# EAGLE design CellAlarm (EAGLE 6.5.0)
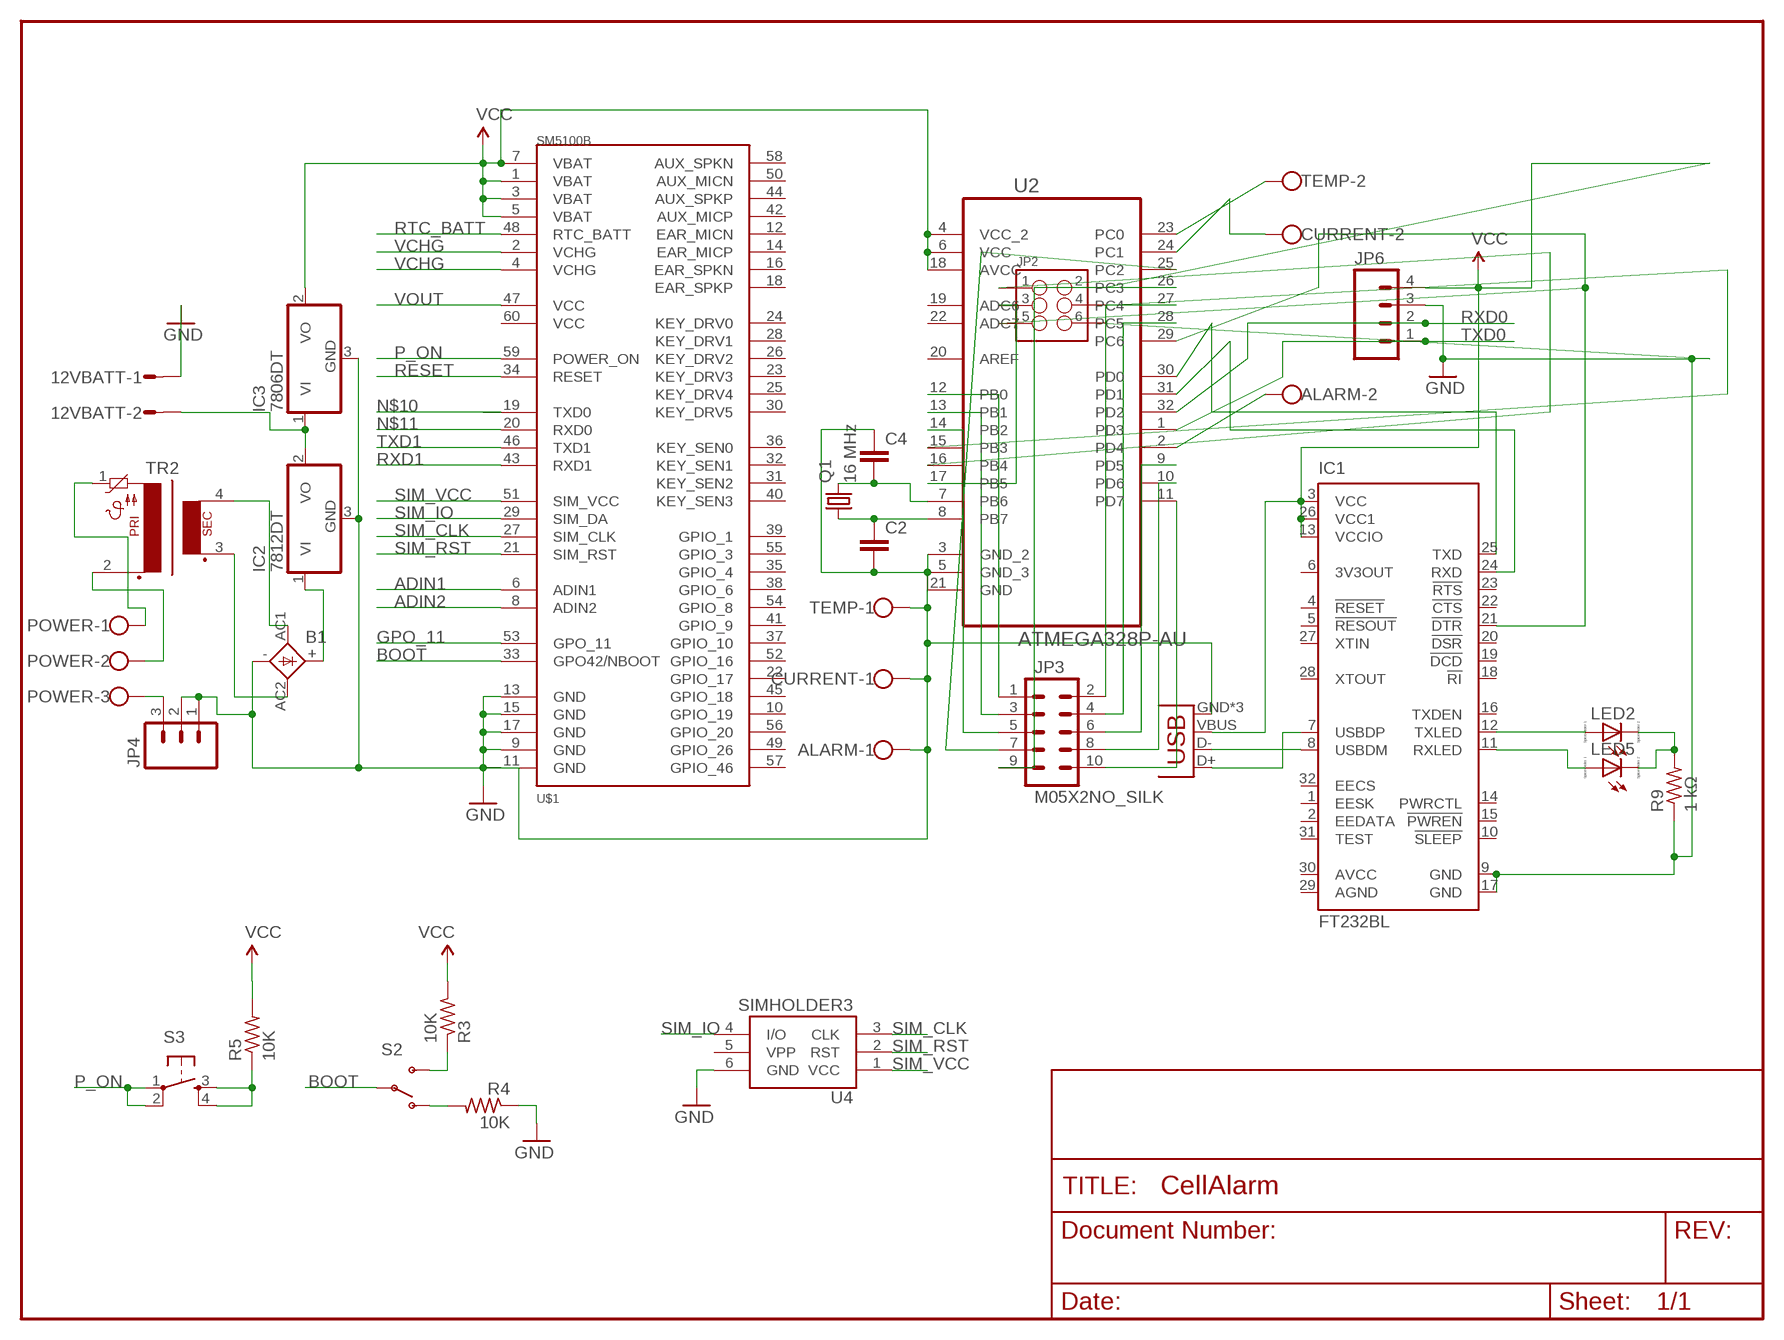
[diagram p0: schematic, sheet 1]

## Parts
12VBATT  M02S  [02P]
ALARM  W239-302  [W239-302]
B1  2KBB-R  [2KBB-R]
C2  C2.5/2  [C2.5-2]
C4  C2.5/2  [C2.5-2]
CURRENT  W239-302  [W239-302]
IC1  FT232BL  [LQFP32-7X7]
IC2  7812DT  [TO252]
IC3  7806DT  [TO252]
JP1  USB-MICROB  [USB-MICROB]
JP2  M03X2NO_SILK  [2X3-NS]
JP3  M05X2NO_SILK  [2X5_NOSILK]
JP4  M03LONGPADS  [1X03_LONGPADS]
JP6  M04PTH  [1X04]
LED2  LED_E  [LED_1206]
LED5  LED_E  [LED_1206]
POWER  W239-103  [W239-103]
Q1  16 MHz  CRYSTALHC33U-V  [HC33U-V]
R3  10K  R-US_R0603  [R0603]
R4  10K  R-US_R0603  [R0603]
R5  10K  R-US_R0603  [R0603]
R9  1 kΩ  R-US_M0805  [M0805]
S2  SWITCH-SPSTSMD  [AYZ0202]
S3  TAC_SWITCHSMD  [TACTILE_SWITCH_SMD]
TEMP  W239-302  [W239-302]
TR2  PT04,5-1  [PT04,5-1]
U2  ATMEGA328P-AU  [QFP80P900X900X120-32N]
U4  SIMHOLDER3  [SIMHOLDER3]
U$1  SM5100B  [SM5100B]

## Nets
ADIN1: U$1.6(ADIN1)
ADIN2: U$1.8(ADIN2)
BOOT: S2.2(P) U$1.33(GPO42/NBOOT)
GND: 12VBATT.1 ALARM.1 B1.- C2.2 C4.1 CURRENT.1 IC1.9(GND) IC1.17(GND) IC2.3(GND) IC3.3(GND) JP1.GND JP1.MT1(GND) JP1.MT2(GND) JP2.6 JP4.1 JP4.2 JP6.3 R4.1 R9.1 TEMP.1 U2.3(GND_2) U2.5(GND_3) U2.21(GND) U4.6(GND) U$1.9(GND) U$1.11(GND) U$1.13(GND) U$1.15(GND) U$1.17(GND)
GPO_11: U$1.53(GPO_11)
N$1: POWER.1 TR2.1
N$2: POWER.2 TR2.2
N$3: B1.AC2 TR2.3
N$4: B1.AC1 TR2.4
N$5: IC1.12(TXLED) LED2.A
N$6: B1.+ IC2.1(VI)
N$7: 12VBATT.2 IC2.2(VO) IC3.1(VI)
N$8: TEMP.2 U2.23(PC0)
N$9: CURRENT.2 U2.24(PC1)
N$10: U$1.19(TXD0)
N$11: U$1.20(RXD0)
N$12: JP4.3 POWER.3
N$15: R3.1 S2.3(S)
N$16: R4.2 S2.1(O)
N$19: ALARM.2 U2.2(PD4)
N$20: R5.1 S3.3 S3.4
N$21: IC1.11(RXLED) LED5.A
N$22: LED2.C LED5.C R9.2
N$25: IC1.7(USBDP) JP1.D+
N$26: IC1.8(USBDM) JP1.D-
N$27: IC1.25(TXD) U2.30(PD0)
N$28: IC1.24(RXD) U2.31(PD1)
N$29: IC1.21(!DTR) JP2.5 U2.29(PC6)
N$31: JP2.4 U2.15(PB3)
N$32: JP2.1 U2.16(PB4)
N$33: JP2.3 U2.17(PB5)
N$34: C4.2 Q1.2 U2.7(PB6)
N$35: C2.1 Q1.1 U2.8(PB7)
N$37: JP3.1 U2.12(PB0)
N$38: JP3.3 U2.13(PB1)
N$39: JP3.5 U2.14(PB2)
N$40: JP3.7 U2.25(PC2)
N$41: JP3.9 U2.26(PC3)
N$42: JP3.2 U2.27(PC4)
N$43: JP3.4 U2.28(PC5)
N$44: JP3.6 U2.9(PD5)
N$45: JP3.8 U2.10(PD6)
N$46: JP3.10 U2.11(PD7)
P_ON: S3.1 S3.2 U$1.59(POWER_ON)
RESET: U$1.34(RESET)
RTC_BATT: U$1.48(RTC_BATT)
RXD0: JP6.2 U2.32(PD2)
RXD1: U$1.43(RXD1)
SIM_CLK: U4.3(CLK) U$1.27(SIM_CLK)
SIM_IO: U4.4(I/O) U$1.29(SIM_DA)
SIM_RST: U4.2(RST) U$1.21(SIM_RST)
SIM_VCC: U4.1(VCC) U$1.51(SIM_VCC)
TXD0: JP6.1 U2.1(PD3)
TXD1: U$1.46(TXD1)
VCC: IC1.3(VCC) IC1.13(VCCIO) IC1.26(VCC1) IC3.2(VO) JP1.VBUS JP2.2 JP6.4 R3.2 R5.2 U2.4(VCC_2) U2.6(VCC) U2.18(AVCC) U$1.1(VBAT) U$1.3(VBAT) U$1.5(VBAT) U$1.7(VBAT)
VCHG: U$1.2(VCHG) U$1.4(VCHG)
VOUT: U$1.47(VCC)
Unconnected: IC1.1(EESK) IC1.2(EEDATA) IC1.4(!RESET) IC1.5(!RESOUT) IC1.6(3V3OUT) IC1.10(!SLEEP) IC1.14(PWRCTL) IC1.15(!PWREN) IC1.16(TXDEN) IC1.18(!RI) IC1.19(!DCD) IC1.20(!DSR) IC1.22(!CTS) IC1.23(!RTS) IC1.27(XTIN) IC1.28(XTOUT) IC1.31(TEST) IC1.32(EECS) U2.19(ADC6) U2.20(AREF) U2.22(ADC7) U4.5(VPP) U$1.10(GPIO_19) U$1.12(EAR_MICN) U$1.14(EAR_MICP) U$1.16(EAR_SPKN) U$1.18(EAR_SPKP) U$1.22(GPIO_17) U$1.23(KEY_DRV3) U$1.24(KEY_DRV0) U$1.25(KEY_DRV4) U$1.26(KEY_DRV2) U$1.28(KEY_DRV1) U$1.30(KEY_DRV5) U$1.31(KEY_SEN2) U$1.32(KEY_SEN1) U$1.35(GPIO_4) U$1.36(KEY_SEN0) U$1.37(GPIO_10) U$1.38(GPIO_6) U$1.39(GPIO_1) U$1.40(KEY_SEN3) U$1.41(GPIO_9) U$1.42(AUX_MICP) U$1.44(AUX_SPKP) U$1.45(GPIO_18) U$1.49(GPIO_26) U$1.50(AUX_MICN) U$1.52(GPIO_16) U$1.54(GPIO_8) U$1.55(GPIO_3) U$1.56(GPIO_20) U$1.57(GPIO_46) U$1.58(AUX_SPKN) U$1.60(VCC)

## Power pins joined to a net without a drawn wire
AGND: IC1.29(AGND)
AVCC: IC1.30(AVCC)

## Library data of the parts
12VBATT = con-amp-quick:M02S: AMP QUICK CONNECTOR; OC_FARNELL: unknown; OC_NEWARK: unknown
ALARM CURRENT TEMP = con-wago-500:W239-302: WAGO SCREW CLAMP; OC_FARNELL: unknown; OC_NEWARK: unknown
B1 = rectifier:2KBB-R: RECTIFIER grid 3 x 5 mm
C2 C4 = capacitor-wima:C: CAPACITOR naming: grid - package width
IC1 = ftdichip:FT232B: USB to serial UART interface Source: DS_FT232BL_BQ.pdf; MF: FARNELL; MPN: FT232BL/TR; OC_FARNELL: unknown; OC_NEWARK: 38K1551
IC2 IC3 = linear:78*: Positive VOLTAGE REGULATOR Source: http://cache.national.com/ds/LM/LM78L05.pdf http://www.fairchildsemi.com/ds/LM/LM7805.pdf
JP1 = SparkFun-Connectors:USB: USB Connectors USB-B-PTH is fully proven SKU : PRT-00139/CONN-08278 USB-miniB is fully proven SKU : PRT-00587 USB-A-PCB is untested. USB-A-H is throughly reviewed, but untested. Spark Fun Electronics SKU : PRT-00437 USB-B-SMT is throughly reviewed, but untested. Needs silkscreen touching up. USB-A-S has not been used/tested USB-MB-H has not been used/tested USB-MICROB has been used. CONN-09505; PROD_ID: CONN-09505
JP2 = SparkFun-Connectors:M03X2: 2x3 .1" header. Shrouded, with keying- CONN-10681 SMT- CONN-11415 Pogo pins- HW-11044
JP3 = SparkFun-Connectors:M05X2: Header 5x2 Standard 10-pin dual row 0.1" header. Commonly used with AVR-ISP. Use with Spark Fun Electronics SKU: PRT-00778
JP4 = SparkFun-Connectors:M03: Header 3 Standard 3-pin 0.1" header. Use with straight break away headers (SKU : PRT-00116), right angle break away headers (PRT-00553), swiss pins (PRT-00743), machine pins (PRT-00117), and female headers (PRT-00115). Molex polarized connector foot print use with SKU : PRT-08232 with associated crimp pins and housings.
JP6 = SparkFun:M04: Header 4 Standard 4-pin 0.1" header. Use with straight break away headers (SKU : PRT-00116), right angle break away headers (PRT-00553), swiss pins (PRT-00743), machine pins (PRT-00117), and female headers (PRT-00115). Molex polarized connector foot print use with SKU : PRT-08231 with associated crimp pins and housings.
LED2 LED5 = eagle-ltspice:LED_E: LED Source: http://www.osram.convergy.de Source: www.luxeon.com Source: www.kingbright.com; SPICEMODEL: NONE; SPICEPREFIX: D; SPICETYPE: diode
POWER = con-wago-500:W239-103: WAGO SCREW CLAMP; MPN: 239-103; OC_FARNELL: unknown; OC_NEWARK: 33M7170
Q1 = crystal:CRYSTAL: CRYSTAL; OC_FARNELL: unknown; OC_NEWARK: unknown
R3-R5 = rcl:R-US_: RESISTOR, American symbol
R9 = resistor:R-US_: RESISTOR, American symbol
S2 = SparkFun:SWITCH-SPST: SPST Switch Simple slide switch. Spark Fun Electronics SKU : COM-00102
S3 = SparkFun:TAC_SWITCH: Momentary Switch Button commonly used for reset or general input. Spark Fun Electronics SKU : COM-00097
TR2 = trafo:PT04,5-1: TRANSFORMER 1 primary winding, temp. protection fuse, 1 secondary winding/ mounting hole BLOCK
U2 = Atmel_By_element14_Batch_1-00:ATMEGA328P-AU: 8-bit Microcontroller with In-System Programmable Flash; MPN: ATMEGA328P-AU; OC_FARNELL: 1715486; OC_NEWARK: 14R4631; PACKAGE: TQFP-32; SUPPLIER: Atmel
U4 = SparkFun:SIMHOLDER3
U$1 = SparkFun:SM5100B

## Net classes
0 default: width 0.203 mm
1 vcc: width 0.254 mm

## Board
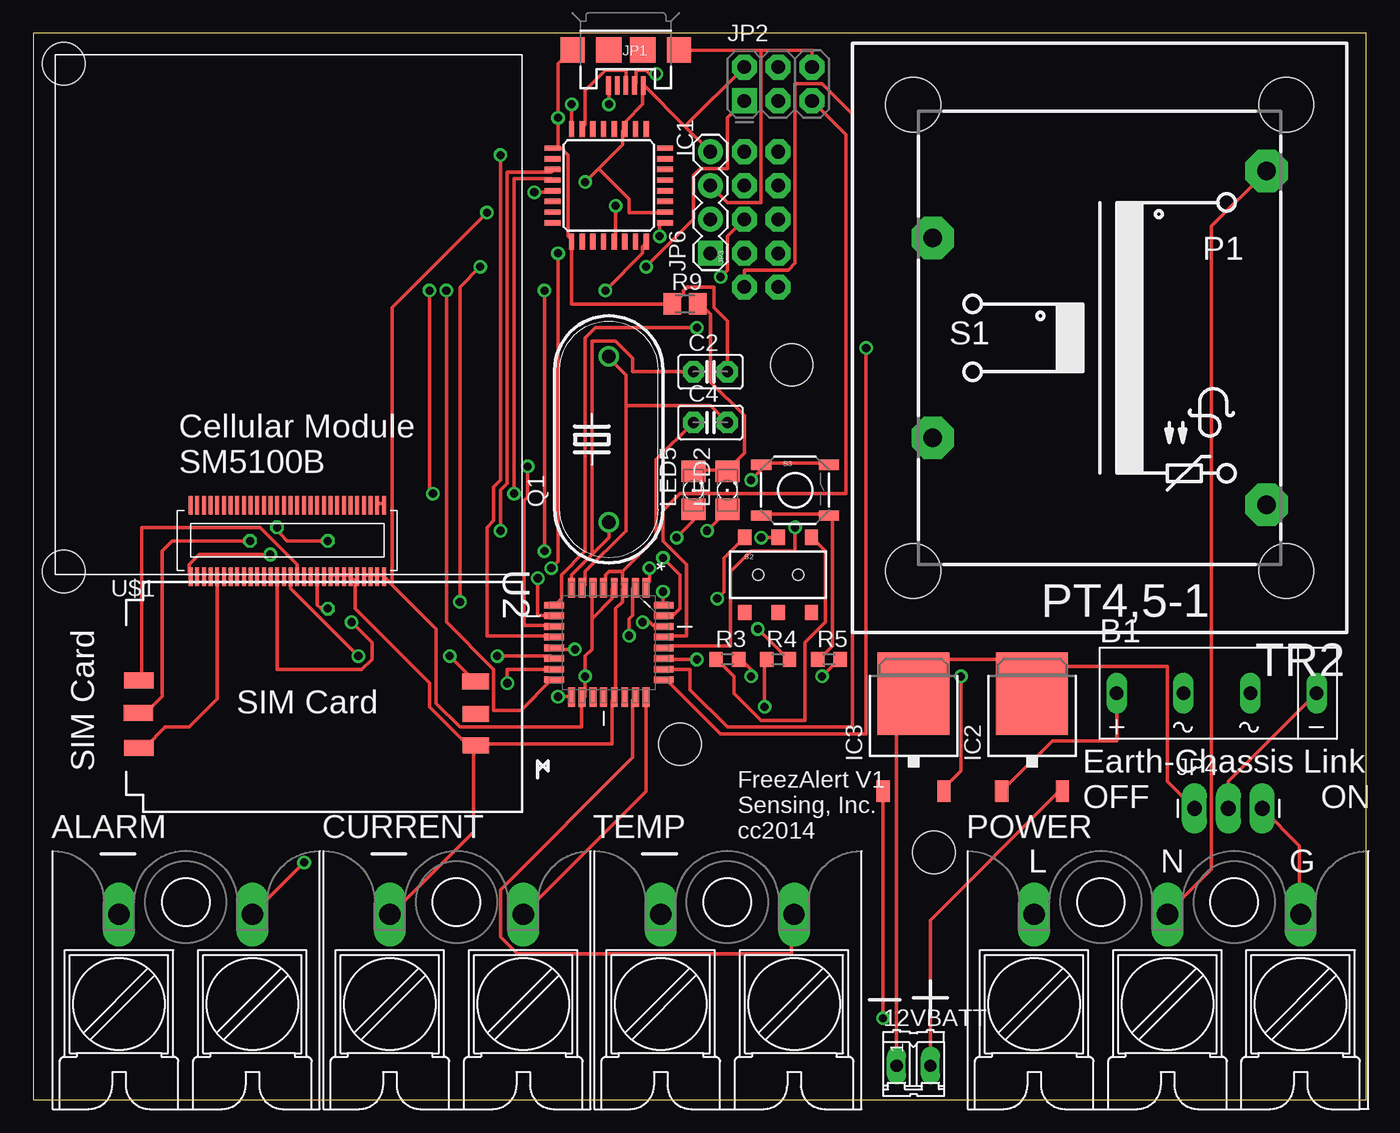
[diagram p1: board, top side]
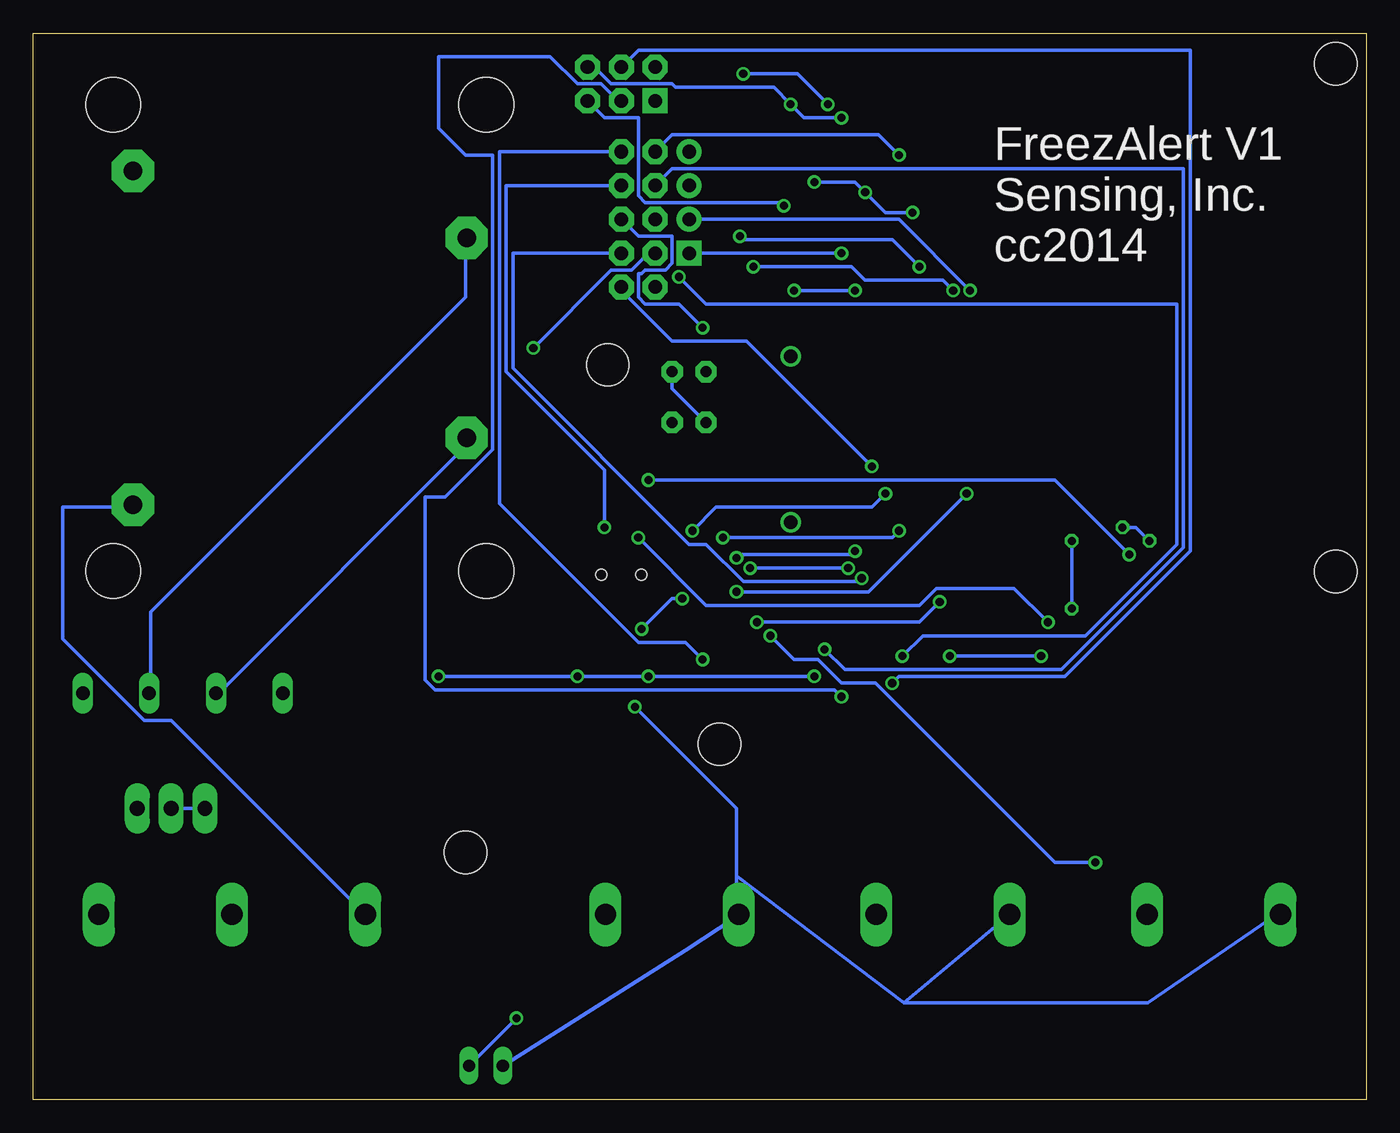
[diagram p2: board, bottom side, seen from below]

Size 100 x 80 mm. Coordinates in mm from the lower left corner, seen from the top.
Outline: 0,0 100,0 100,80 0,80 0,0
Copper layers (1*16): Top 0.035mm / dielectric 1.5mm / Bottom 0.035mm
Design rules "default": minimum track width 10mil, minimum drill 24mil, track to track 8mil, track to pad 8mil, pad to pad 8mil, via to via 8mil, smd to smd 8mil, copper to edge 40mil, drill to drill 8mil, minimum pad ring 10mil, minimum via ring 8mil, stop-mask expansion 4mil, vias tented up to drill 0mil, thermal gap 10mil
Holes 3.17 mm at 2.29,77.72 67.56,18.54 48.51,26.67 56.9,55.12 2.29,39.62

### Footprints (pad centres in the part's own frame; a part is rotated, then mirrored left to right if it is on the bottom)
02P = drill 0.914 long: 1 -1.27,0; 2 1.27,0
W239-302 = drill 1.6 long: 1 -5,5; 2 5,5
2KBB-R = drill 1.016 long: + -7.62,0; - 7.391,0; AC1 -2.616,0; AC2 2.413,0
C2.5-2 = drill 0.813 pad 1.6 octagon: 1 -1.27,0; 2 1.27,0
LQFP32-7X7 = smd 1.2 x 0.4: 1 -4.225,2.8; 2 -4.225,2; 3 -4.225,1.2; 4 -4.225,0.4; 5 -4.225,-0.4; 6 -4.225,-1.2; 7 -4.225,-2; 8 -4.225,-2.8; 17 4.225,-2.8; 18 4.225,-2; 19 4.225,-1.2; 20 4.225,-0.4; 21 4.225,0.4; 22 4.225,1.2; 23 4.225,2; 24 4.225,2.8 | smd 0.4 x 1.2: 9 -2.8,-4.225; 10 -2,-4.225; 11 -1.2,-4.225; 12 -0.4,-4.225; 13 0.4,-4.225; 14 1.2,-4.225; 15 2,-4.225; 16 2.8,-4.225; 25 2.8,4.225; 26 2,4.225; 27 1.2,4.225; 28 0.4,4.225; 29 -0.4,4.225; 30 -1.2,4.225; 31 -2,4.225; 32 -2.8,4.225
TO252 = smd 1 x 1.6: 1 -2.28,-4.8; 2 2.28,-4.8 | smd 5.4 x 6.2: 3 0,2.5
USB-MICROB = smd 0.35 x 1.4: D+ 0,2.65; D- -0.65,2.65; GND 1.3,2.65; ID 0.65,2.65; VBUS -1.3,2.65 | smd 1.8 x 1.9: MT1 -4,0; MT2 4,0 | smd 1.9 x 1.9: P$1 -1.27,0; P$2 1.27,0
2X3-NS = drill 1.016 pad 1.88 square: 1 -2.54,-1.27 | drill 1.016 pad 1.88 octagon: 2 -2.54,1.27; 3 0,-1.27; 4 0,1.27; 5 2.54,-1.27; 6 2.54,1.27
2X5_NOSILK = drill 1.016 pad 1.88 octagon: 1 -1.27,5.08; 2 1.27,5.08; 3 -1.27,2.54; 4 1.27,2.54; 5 -1.27,0; 6 1.27,0; 7 -1.27,-2.54; 8 1.27,-2.54; 9 -1.27,-5.08; 10 1.27,-5.08
1X03_LONGPADS = drill 1.118 pad 1.88 long: 1 0,0; 2 2.54,0; 3 5.08,0
1X04 = drill 1.016 pad 1.88 square: 1 0,0 | drill 1.016 pad 1.88: 2 2.54,0; 3 5.08,0; 4 7.62,0
LED_1206 = smd 1.6 x 1.803: A -1.422,0; C 1.422,0
W239-103 = drill 1.6 long: 1 -10,5; 2 0,5; 3 10,5
HC33U-V = drill 1.016: 1 -6.223,0; 2 6.223,0
R0603 = smd 1 x 1.1: 1 -0.85,0; 2 0.85,0
M0805 = smd 1.3 x 1.6: 1 -0.95,0; 2 0.95,0
AYZ0202 = smd 1 x 1.15: 1 -2.5,2.825; 2 0,2.825; 3 2.5,2.825; 4 -2.5,-2.825; 5 0,-2.825; 6 2.5,-2.825 | hole 0.85: 1.5,0; -1.5,0
TACTILE_SWITCH_SMD = smd 1.524 x 0.762: 1 -2.54,1.905; 2 2.54,1.905; 3 -2.54,-1.905; 4 2.54,-1.905
PT04,5-1 = drill 1.397 pad 3.175 octagon: 1 -12.522,12.522; 2 -12.522,-12.522; 3 12.522,-7.493; 4 12.522,7.493 | hole 4.115: -13.995,-17.501; -13.995,17.501; 13.995,17.501; 13.995,-17.501
QFP80P900X900X120-32N = smd 1.473 x 0.508: 1 -4.115,2.794; 2 -4.115,2.007; 3 -4.115,1.194; 4 -4.115,0.406; 5 -4.115,-0.406; 6 -4.115,-1.194; 7 -4.115,-2.007; 8 -4.115,-2.794; 17 4.115,-2.794; 18 4.115,-2.007; 19 4.115,-1.194; 20 4.115,-0.406; 21 4.115,0.406; 22 4.115,1.194; 23 4.115,2.007; 24 4.115,2.794 | smd 0.508 x 1.473: 9 -2.794,-4.115; 10 -2.007,-4.115; 11 -1.194,-4.115; 12 -0.406,-4.115; 13 0.406,-4.115; 14 1.194,-4.115; 15 2.007,-4.115; 16 2.794,-4.115; 25 2.794,4.115; 26 2.007,4.115; 27 1.194,4.115; 28 0.406,4.115; 29 -0.406,4.115; 30 -1.194,4.115; 31 -2.007,4.115; 32 -2.794,4.115
SIMHOLDER3 = smd 2.2 x 1.2: 1 0.95,4.81; 2 0.91,7.41; 3 0.95,9.86 | smd 2 x 1.2: 4 26.2,9.78; 5 26.22,7.34; 6 26.22,4.98
SM5100B = smd 0.3 x 1.4: 1 7.25,-2.68; 2 7.25,2.68; 3 6.75,-2.68; 4 6.75,2.68; 5 6.25,-2.68; 6 6.25,2.68; 7 5.75,-2.68; 8 5.75,2.68; 9 5.25,-2.68; 10 5.25,2.68; 11 4.75,-2.68; 12 4.75,2.68; 13 4.25,-2.68; 14 4.25,2.68; 15 3.75,-2.68; 16 3.75,2.68; 17 3.25,-2.68; 18 3.25,2.68; 19 2.75,-2.68; 20 2.75,2.68; 21 2.25,-2.68; 22 2.25,2.68; 23 1.75,-2.68; 24 1.75,2.68; 25 1.25,-2.68; 26 1.25,2.68; 27 0.75,-2.68; 28 0.75,2.68; 29 0.25,-2.68; 30 0.25,2.68; 31 -0.25,-2.68; 32 -0.25,2.68; 33 -0.75,-2.68; 34 -0.75,2.68; 35 -1.25,-2.68; 36 -1.25,2.68; 37 -1.75,-2.68; 38 -1.75,2.68; 39 -2.25,-2.68; 40 -2.25,2.68; 41 -2.75,-2.68; 42 -2.75,2.68; 43 -3.25,-2.68; 44 -3.25,2.68; 45 -3.75,-2.68; 46 -3.75,2.68; 47 -4.25,-2.68; 48 -4.25,2.68; 49 -4.75,-2.68; 50 -4.75,2.68; 51 -5.25,-2.68; 52 -5.25,2.68; 53 -5.75,-2.68; 54 -5.75,2.68; 55 -6.25,-2.68; 56 -6.25,2.68; 57 -6.75,-2.68; 58 -6.75,2.68; 59 -7.25,-2.68; 60 -7.25,2.68

### Placement (x,y rotation side)
12VBATT  66.04,2.54 0 top
ALARM  11.43,8.89 0 top
B1  88.9,30.48 0 top
C2  50.8,54.61 0 top
C4  50.8,50.8 0 top
CURRENT  31.75,8.89 0 top
IC1  43.18,68.58 270 top
IC2  74.93,27.94 0 top
IC3  66.04,27.94 0 top
JP1  44.45,78.74 180 top
JP2  55.88,76.2 0 top
JP3  54.61,66.04 0 top
JP4  87.12,21.84 0 top
JP6  50.8,63.5 90 top
LED2  52.07,45.72 90 top
LED5  49.53,45.72 90 top
POWER  85.09,8.89 0 top
Q1  43.18,49.53 90 top
R3  52.07,33.02 0 top
R4  55.88,33.02 0 top
R5  59.69,33.02 0 top
R9  48.9,59.69 0 top
S2  55.88,39.37 0 top
S3  57.15,45.72 0 top
TEMP  52.07,8.89 0 top
TR2  80.01,57.15 180 top
U2  43.18,34.29 270 top
U4  6.99,21.59 0 top
U$1  19.05,41.91 0 top

### Tracks (layer width: path | path; a pad name or v marks a point on that pad's centre or on a via)
BOOT  (via drill 0.61)
  Top 0.254: v54.61,42.16 55.88,42.16 S2.2 | v23.88,35.81 25.4,34.29 25.4,33.02 24.64,32.26 18.29,32.26 18.29,39.12 U$1.33
  Bottom 0.254: v54.61,42.16 49.53,37.08 33.53,37.08 32.26,38.35 26.42,38.35 v23.88,35.81
GND  (via drill 0.61)
  Top 0.254: 74.93,32.51 IC2.3 74.93,30.48 | 74.93,32.51 74.93,33.02 68.58,33.02 66.04,30.48 IC3.3 66.04,30.23 64.77,28.96 12VBATT.1 | JP4.2 89.66,23.88 96.27,30.48 B1.- | 74.93,32.51 85.09,32.51 85.09,23.88 JP4.1 | v54.86,29.46 54.86,33.02 R4.1 | v43.18,74.68 43.18,75.95 JP1.GND | 54.61,78.74 58.42,78.74 JP2.6 | 54.61,78.74 JP1.MT1 | JP6.3 52.07,67.31 54.61,67.31 54.61,78.74 | 39.37,71.37 39.12,71.37 IC1.9 39.37,71.37 | 39.37,71.37 39.62,71.37 40.13,70.87 40.13,64.77 40.39,64.52 IC1.17 40.39,64.26 40.39,59.69 R9.1 48.01,59.69 48.77,60.45 48.77,60.71 49.02,60.96 51.05,60.96 51.05,59.44 52.07,58.42 C2.2 | 39.37,71.37 v39.37,73.66 39.37,77.72 40.39,78.74 JP1.MT2 | 22.86,39.37 22.35,39.37 U$1.17 | 22.86,39.37 23.37,39.37 | 22.86,39.37 U$1.15 | 23.37,39.37 23.88,39.37 U$1.11 23.88,39.12 24.13,38.86 | 23.37,39.37 U$1.13 | 24.13,38.86 24.13,36.83 29.72,31.24 29.72,29.46 32.51,26.67 33.02,26.67 U4.6 | 44.2,39.62 43.18,39.62 42.93,39.37 42.93,38.61 U2.5 | 44.2,39.62 44.2,38.61 U2.3 44.2,38.35 44.2,37.34 43.69,36.83 43.69,30.23 U2.21 43.43,29.97 43.43,26.67 33.27,26.67 U4.6 | 44.2,39.62 46.74,42.16 46.74,48.01 C4.1 | CURRENT.1 26.92,13.97 33.02,20.07 33.02,26.42 U4.6 | 24.13,38.86 24.3,38.86 U$1.9
  Bottom 0.254: JP4.2 JP4.1 | v54.86,29.46 47.24,21.84 47.24,16.76 | 47.24,16.76 47.24,13.97 TEMP.1 47.24,13.72 51.05,11.18 12VBATT.1 | 34.67,7.24 16.38,7.24 6.6,13.97 ALARM.1 | CURRENT.1 34.67,7.24 | JP2.6 57.91,77.47 56.64,76.2 52.07,76.2 51.82,75.95 44.45,75.95 v43.18,74.68 42.16,73.66 v39.37,73.66 | C4.1 52.07,53.34 C2.2 | 34.67,7.24 47.24,16.76
N$1
  Bottom 0.254: POWER.1 75.18,13.97 89.66,28.45 91.69,28.45 97.79,34.54 97.79,44.45 92.71,44.45 TR2.1
N$2
  Top 0.254: TR2.2 88.39,65.53 88.39,17.27 85.09,13.97 POWER.2
N$3
  Bottom 0.254: B1.AC2 91.19,30.48 91.19,36.58 67.56,60.2 67.56,64.52 TR2.3
N$4
  Bottom 0.254: B1.AC1 86.11,30.48 67.56,49.02 67.56,49.53 TR2.4
N$5  (via drill 0.61)
  Top 0.254: v36.07,45.47 36.07,69.09 38.86,69.09 IC1.12 | v50.55,42.67 52.07,44.2 LED2.A
  Bottom 0.254: v36.07,45.47 37.08,44.45 48.77,44.45 v50.55,42.67
N$6
  Top 0.254: B1.+ 81.28,26.92 76.45,26.92 72.9,23.37 IC2.1
N$7  (via drill 0.61)
  Top 0.254: v63.75,6.1 63.75,23.11 IC3.1 | 12VBATT.2 67.31,13.46 76.96,23.11 IC2.2
  Bottom 0.254: 12VBATT.2 v63.75,6.1
N$8
  Top 0.254: U2.23 44.96,29.97 44.96,25.65 35.05,15.75 35.05,12.19 36.32,10.92 56.9,10.92 56.9,13.72 TEMP.2
N$9
  Top 0.254: U2.24 45.97,23.11 CURRENT.2
N$12
  Top 0.254: JP4.3 95,19.05 95,13.97 POWER.3
N$13  (via drill 0.6 pad 0.25)
  other vias: 22.1,36.83
N$14  (via drill 0.6 pad 0.25)
  other vias: 18.29,42.93
N$15
  Top 0.254: R3.1 51.31,33.02 52.58,31.75 52.58,30.48 54.61,28.45 57.91,28.45 57.91,34.29 59.44,35.81 59.44,41.15 58.42,42.16 S2.3
N$16  (via drill 0.61)
  Top 0.254: v54.36,35.31 56.64,33.02 R4.2 | v51.31,37.59 51.82,38.1 51.82,40.64 53.34,42.16 S2.1
  Bottom 0.254: v54.36,35.31 52.07,37.59 v51.31,37.59
N$19  (via drill 0.61)
  Top 0.254: v44.7,34.8 44.7,36.07 44.96,36.32 44.96,38.35 U2.2 | ALARM.2 v20.32,17.78
  Bottom 0.254: v44.7,34.8 42.93,33.02 41.15,33.02 39.37,31.24 36.83,31.24 23.37,17.78 v20.32,17.78
N$20
  Top 0.254: R5.1 58.93,33.02 59.94,34.04 59.94,43.43 59.69,43.69 S3.4 59.69,43.94 54.61,43.94 S3.3
N$21  (via drill 0.61)
  Top 0.254: v35.05,42.67 35.05,45.72 35.56,46.23 35.56,69.6 38.86,69.6 IC1.11 | v48.26,42.16 49.53,43.43 LED5.A
  Bottom 0.254: v35.05,42.67 35.56,42.16 v48.26,42.16
N$22
  Top 0.254: 52.07,47.24 53.34,48.51 53.34,51.31 50.8,53.85 50.8,58.93 50.04,59.69 R9.2 | 52.07,47.24 49.53,47.24 LED5.C | 52.07,47.24 LED2.C
N$25
  Top 0.254: JP1.D+ 44.45,77.22 42.93,77.22 41.4,75.69 41.4,73.15 41.15,72.9 IC1.7
N$26  (via drill 0.61)
  Top 0.254: v40.39,74.68 40.39,72.9 IC1.8 | v46.74,76.96 46.23,76.96 45.97,77.22 45.21,77.22 45.21,76.2 JP1.D-
  Bottom 0.254: v40.39,74.68 42.67,76.96 v46.74,76.96
N$27  (via drill 0.61)
  Top 0.254: v46.99,64.77 46.99,65.53 47.24,65.79 IC1.25 | v33.53,62.48 32,60.96 v32,37.34 | v45.72,35.81 46.23,35.81 46.48,35.56 47.24,35.56 U2.30
  Bottom 0.254: v46.99,64.77 46.74,64.52 35.56,64.52 v33.53,62.48 | v32,37.34 33.53,35.81 v45.72,35.81
N$28  (via drill 0.61)
  Top 0.254: v42.93,60.71 45.72,63.5 45.72,64.01 45.97,64.26 IC1.24 | v38.35,41.15 v38.35,60.71 | v47.24,40.64 48.51,39.37 48.51,36.83 48.01,36.32 47.5,36.32 U2.31
  Bottom 0.254: v38.35,60.71 v42.93,60.71 | v38.35,41.15 38.61,40.89 46.99,40.89 v47.24,40.64
N$29  (via drill 0.61)
  Top 0.254: v43.69,67.06 43.69,64.52 IC1.21 | JP2.5 60.96,72.39 60.96,45.47 48.51,45.47 47.24,44.2 47.24,41.91 49.02,40.13 49.02,34.8 47.5,34.8 U2.29
  Bottom 0.254: v43.69,67.06 43.94,67.31 54.1,67.31 54.61,67.82 54.61,73.66 57.15,73.66 JP2.5
N$31  (via drill 0.61)
  Top 0.254: v35.56,31.24 35.56,32.26 38.86,32.26 U2.15
  Bottom 0.254: v35.56,31.24 35.05,31.75 22.61,31.75 13.21,41.15 13.21,78.74 54.61,78.74 JP2.4
N$32  (via drill 0.61)
  Top 0.254: v30.99,60.71 30.99,35.81 34.54,32.26 34.54,29.21 36.58,29.21 38.86,31.5 U2.16 | v45.97,62.48 49.53,66.04 49.53,69.34 50.04,69.85 52.07,69.85 52.07,73.66 JP2.1
  Bottom 0.254: v30.99,60.71 31.75,61.47 37.59,61.47 38.61,62.48 v45.97,62.48
N$33  (via drill 0.61)
  Top 0.254: v39.37,30.23 40.39,30.23 U2.17
  Bottom 0.254: v39.37,30.23 39.88,30.73 69.85,30.73 70.61,31.5 70.61,45.21 69.09,45.21 65.53,48.77 65.53,70.87 67.56,70.87 69.6,72.9 69.6,78.23 61.21,78.23 59.18,76.2 57.4,76.2 56.13,74.93 JP2.3
N$34
  Top 0.254: 44.45,52.07 44.45,54.36 43.18,55.63 Q1.2 | 44.45,52.07 44.45,42.67 41.4,39.62 41.4,38.61 U2.7 | C4.2 50.8,52.07 44.45,52.07
N$35
  Top 0.254: U2.8 40.39,39.37 41.91,40.89 | 41.91,40.89 43.18,42.16 Q1.1 | C2.1 44.96,54.61 44.96,55.63 43.69,56.9 41.91,56.9 41.91,40.89
N$37  (via drill 0.61)
  Top 0.254: v35.05,70.87 35.05,46.48 34.54,45.97 34.54,43.43 34.04,42.93 34.04,34.8 38.86,34.8 U2.12
  Bottom 0.254: v35.05,70.87 36.58,72.39 52.07,72.39 JP3.1
N$38  (via drill 0.61)
  Top 0.254: v40.64,33.78 39.12,33.78 U2.13
  Bottom 0.254: v40.64,33.78 39.12,32.26 22.86,32.26 13.72,41.4 13.72,69.85 52.07,69.85 JP3.3
N$39  (via drill 0.61)
  Top 0.254: v34.8,33.27 38.86,33.27 U2.14 | v51.56,61.72 52.07,62.23 52.07,64.77 JP3.5
  Bottom 0.254: v34.8,33.27 33.27,34.8 21.08,34.8 14.22,41.66 14.22,59.69 49.53,59.69 v51.56,61.72
N$40  (via drill 0.61)
  Top 0.254: v62.48,56.39 62.48,27.43 51.56,27.43 47.5,31.5 U2.25
  Bottom 0.254: v62.48,56.39 56.64,62.23 55.12,62.23 53.85,63.5 JP3.7
N$41
  Top 0.254: JP3.9 53.34,62.23 56.64,62.23 57.15,62.74 57.15,76.2 59.18,76.2 61.47,73.91 61.47,27.94 52.07,27.94 49.28,30.73 49.28,32.26 47.5,32.26 U2.26
N$42  (via drill 0.61)
  Top 0.254: v49.78,33.02 47.5,33.02 U2.27
  Bottom 0.254: v49.78,33.02 51.05,34.29 54.61,34.29 65.02,44.7 65.02,71.12 JP3.2
N$43  (via drill 0.61)
  Top 0.254: v57.15,42.93 57.15,41.15 53.85,41.15 52.32,39.62 52.32,34.04 47.5,34.04 U2.28
  Bottom 0.254: v57.15,42.93 57.15,47.24 64.52,54.61 64.52,68.58 JP3.4
N$44  (via drill 0.61)
  Top 0.254: v49.78,57.91 42.16,57.91 41.4,57.15 41.4,41.15 39.62,39.37 39.62,37.59 39.12,37.08 U2.9
  Bottom 0.254: v49.78,57.91 51.56,59.69 54.1,59.69 54.61,60.2 54.61,61.98 54.36,61.98 54.1,62.23 52.58,62.23 52.07,62.74 52.07,64.77 54.61,64.77 JP3.6
N$45  (via drill 0.61)
  Top 0.254: v37.85,39.12 37.85,36.32 38.86,36.32 U2.10
  Bottom 0.254: v37.85,39.12 38.1,38.86 46.74,38.86 49.53,41.66 50.8,41.66 64.01,54.86 64.01,63.5 JP3.8
N$46  (via drill 0.61)
  Top 0.254: v37.08,47.5 37.08,45.21 36.83,44.96 36.83,35.56 38.86,35.56 U2.11
  Bottom 0.254: v37.08,47.5 46.48,56.9 52.07,56.9 55.88,60.71 JP3.10
P_ON  (via drill 0.61)
  Top 0.254: v17.78,40.89 12.45,40.89 11.68,40.13 11.68,39.37 U$1.59 | v53.85,46.48 54.61,47.24 S3.1 54.61,47.75 59.69,47.75 S3.2
  Bottom 0.254: v17.78,40.89 23.37,46.48 v53.85,46.48
RXD0  (via drill 0.61)
  Top 0.254: v47.24,38.1 47.24,37.08 U2.32 | v29.97,45.47 29.72,45.72 v29.72,60.71
  Bottom 0.254: v47.24,38.1 37.34,38.1 v29.97,45.47 | v29.72,60.71 35.05,66.04 JP6.2
SIM_CLK
  Top 0.254: U$1.27 19.81,39.37 19.81,40.13 17.02,42.93 8.13,42.93 8.13,31.5 U4.3
SIM_IO  (via drill 0.61)
  Top 0.254: v24.38,33.27 19.3,38.35 19.3,39.12 U$1.29 | v31.24,33.27 33.02,31.5 U4.4
  Bottom 0.254: v31.24,33.27 v24.38,33.27
SIM_RST  (via drill 0.6 pad 0.25)
  Top 0.254: U$1.21 21.3,37.12 21.59,36.83 v22.1,36.83 | v22.1,41.91 19.05,41.91 18.54,42.42 18.54,42.67 v18.29,42.93 | v16.26,41.91 10.41,41.91 9.65,41.15 9.65,30.23 8.64,29.21 8.11,29.21 U4.2
  Bottom 0.254: v22.1,36.83 v22.1,41.91 | v18.29,42.93 17.27,42.93 v16.26,41.91
SIM_VCC
  Top 0.254: U$1.51 13.8,30.06 11.68,27.94 9.91,27.94 8.38,26.42 7.95,26.42 U4.1
TXD0  (via drill 0.61)
  Top 0.254: v46.23,39.88 46.23,38.86 45.97,38.61 U2.1 | v38.86,39.88 39.37,40.39 v39.37,63.5
  Bottom 0.254: v38.86,39.88 v46.23,39.88 | JP6.1 v39.37,63.5
VCC  (via drill 0.61)
  Top 0.254: v37.59,68.07 38.86,68.07 IC1.13 | 42.42,69.85 44.2,71.63 44.2,72.64 IC1.3 44.45,72.9 44.45,73.41 45.72,74.68 45.72,75.95 JP1.VBUS 45.72,76.2 49.02,72.9 | 42.42,69.85 v41.4,68.83 | 42.42,69.85 44.7,67.56 44.7,66.55 47.24,66.55 IC1.26 | 49.02,72.9 JP6.4 | JP2.2 49.02,73.15 49.02,72.9 | v53.85,31.75 53.85,32.26 53.09,33.02 R3.2 | v59.18,31.75 60.45,33.02 R5.2 | v69.6,31.75 69.6,24.64 68.33,23.37 IC3.2 | 25.4,39.37 24.89,39.37 U$1.7 | 25.4,39.37 25.65,39.37 U$1.3 25.91,39.37 26.16,39.37 U$1.1 26.42,39.12 26.92,38.61 | 25.4,39.37 U$1.5 | 41.91,36.07 41.91,38.35 U2.6 | 41.91,36.07 41.91,33.78 41.4,33.27 v41.4,31.75 41.4,30.23 U2.18 41.15,29.97 41.15,27.94 32,27.94 30.23,29.72 30.23,35.31 26.92,38.61 | 41.91,36.07 43.43,37.59 43.43,38.35 U2.4 | v34.04,66.55 26.92,59.44 26.92,38.61
  Bottom 0.254: v41.4,68.83 38.35,68.83 v37.59,68.07 36.07,66.55 v34.04,66.55 | v69.6,31.75 v59.18,31.75 v53.85,31.75 v41.4,31.75
VCHG
  Top 0.254: U$1.4 25.91,44.7 26.16,44.7 U$1.2

### Text on the board
tPlace: Cellular Module / SM5100B | SIM Card | SIM Card | Earth-Chassis Link / OFF ON | FreezAlert V1 / Sensing, Inc. / cc2014 | L | N | G
bPlace: FreezAlert V1 / Sensing, Inc. / cc2014